# Altium schematic sheet SH6 - 17V POWER.SchDoc: Load Monitoring 2
size B; DrawnBy: Farris Matar; Engineer: Farris Matar; Organization: UW Robotics; Address1: 200 University Avenue; Address2: Waterloo; Address3: Ontario; Address4: Canada N2L 3G6; DocumentNumber: 6; Revision: 3; SheetNumber: 6; SheetTotal: 9
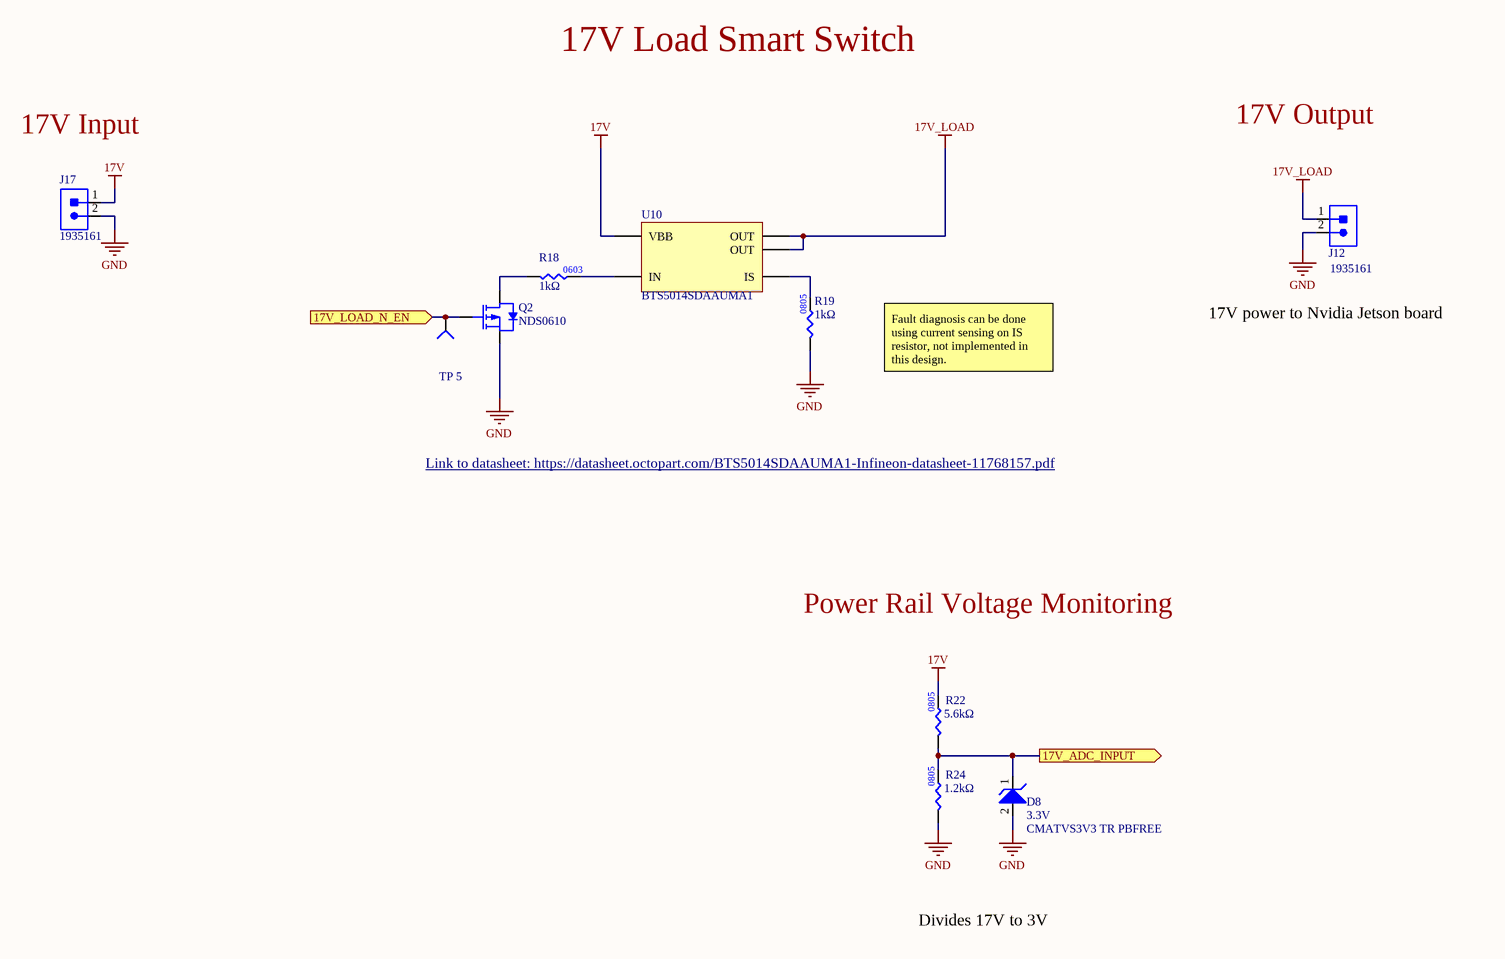
[diagram p0: SH6 - 17V POWER.SchDoc]

## Parts
D8  Manufacturer Part Number 1: CMATVS3V3 TR PBFREE  Voltage - Reverse Standoff (Typ): 3.3V  [SOD-923]  (hidden comment: TVS_DIODE_UNIDIR_3.3V_7A)
J12  CON_2M_TERM  [1935161]  (value not drawn)
J17  CON_2M_TERM  [1935161]  (value not drawn)
Q2  Manufacturer Part Number 1: NDS0610  [SOT23-3]  (hidden comment: PMOS_60V_120mA)
R18  value 1kΩ  [RES0603]  (hidden comment: RES_1kΩ_0603_5%)
R19  value 1kΩ  [RES0805]  (hidden comment: RES_1kΩ_0805_1%)
R22  value 5.6kΩ  [RES0805]  (hidden comment: RES_5.6kΩ_0805)
R24  value 1.2kΩ  [RES0805]  (hidden comment: RES_1.2kΩ_0805)
TP_5  TESTPOINT_1MM_CIRCLE  [TESTPOINT_CIRCLE_1MM]  (value not drawn)  (no BOM)
U10  BTS5014SDAAUMA1  [D2PAK-4]

## Ports
17V_ADC_INPUT (out), 17V_LOAD_N_EN (in)

## Nets
17V: J17.1 R22.2 U10.3(VBB)
17V_LOAD: J12.1 U10.1(OUT) U10.5(OUT)
GND: D8.2 J12.2 J17.2 Q2.2(Source) R19.1 R24.1
17V_ADC_INPUT: D8.1 R22.1 R24.2 ; port 17V_ADC_INPUT
17V_LOAD_N_EN: Q2.1(Gate) TP_5.1(=value) ; port 17V_LOAD_N_EN
NetQ2_3: Q2.3(Drain) R18.1
NetR18_2: R18.2 U10.2(IN)
NetR19_2: R19.2 U10.4(IS)

## Notes on the sheet
- 17V Load Smart Switch
- 17V Input
- 17V Output
- Fault diagnosis can be done using current sensing on IS resistor, not implemented in this design.
- 17V power to Nvidia Jetson board
- Link to datasheet: https://datasheet.octopart.com/BTS5014SDAAUMA1-Infineon-datasheet-11768157.pdf <https://datasheet.octopart.com/BTS5014SDAAUMA1-Infineon-datasheet-11768157.pdf>
- Power Rail Voltage Monitoring
- Divides 17V to 3V
- Title:
- Project:
- Date:
- Rev:
- Reviewer:
- Engineer:
- Sheet:
- of

## Library data of the parts
D8 = TVS_DIODE_UNIDIR_3.3V_7A: TVS DIODE 3.3VWM 11VC SOD923; Manufacturer 1: Central Semiconductor Corp; Voltage - Breakdown (Min): 5V; Voltage - Clamping (Max) @ Ipp: 11V; Mounting Type: SMD; Package/Footprint: SOD-923; Supplier 1: Digi-Key; Supplier Part Number 1: 1514-CMATVS3V3TRPBFREECT-ND; Supplier 2: Mouser; Supplier Part Number 2: 610-CMATVS3V3
J12 J17 = CON_2M_TERM: TERM BLK 2POS SIDE ENTRY 5MM; Manufacturer 1: Phoenix Contact; Max Current Rating: 16A; Current: 18A; Voltage: 300V; Package/Footprint: SMD; Supplier 1: Digi-Key; Supplier Part Number 1: 277-1667-ND; Manufacturer Part Number 1: 1935161; Mounting Type: TH
Q2 = PMOS_60V_120mA: MOSFET P-CH 60V 120MA SOT-23; Manufacturer 1: ON Semiconductor; Vgs (Max): ±20V; Vdss: 60V; Package/Footprint: SOT-23; Mounting Type: SMD; Id: 120mA; Supplier 1: Digi-Key; Supplier Part Number 1: NDS0610CT-ND
R18 = RES_1kΩ_0603_5%: RES 1K OHM 5% 1/10W 0603; Manufacturer 1: Yageo; Manufacturer Part Number 1: RC0603JR-071KL; Supplier Part Number 1: 311-1.0KGRCT-ND; Supplier 1: Digi-Key; Mounting Type: SMD; Package: 0603
R19 = RES_1kΩ_0805_1%: RES 1K OHM 1% 1/8W 0805; Manufacturer 1: Yageo; Manufacturer Part Number 1: RC0805FR-071KL; Supplier 1: Digi-Key; Mounting Type: SMD; Supplier Part Number 1: 311-1.00KCRCT-ND; LCSC Part #: C17513; Package: 0805
R22 = RES_5.6kΩ_0805_5%: RES 5.6K OHM 5% 1/8W 0805; Manufacturer 1: Yageo; Manufacturer Part Number 1: RC0805JR-075K6L; Supplier Part Number 1: 311-5.6KARCT-ND; Supplier 1: Digi-Key; Tolerance: 5%; Package: 0805
R24 = RES_1.2kΩ_0805_5%: RES 1.2K OHM 5% 1/8W 0805; Manufacturer 1: Yageo; Manufacturer Part Number 1: RC0805JR-071K2L; Supplier 1: Digi-Key; Supplier Part Number 1: 311-1.2KARCT-ND; Tolerance: 5%; Package: 0805
TP_5 = TESTPOINT_1MM_CIRCLE: TESTPOINT 1MM CIRCLE
U10 = BTS5014SDAAUMA1: IC PWR SWITCH N-CHAN 1:1 TO252-5; Manufacturer 1: Infineon Technologies; Package/Footprint: TO-252-5; Mounting Type: SMD; Manufacturer Part Number 1: BTS5014SDAAUMA1; Supplier 1: Digi-Key; Supplier Part Number 1: BTS5014SDAAUMA1CT-ND; Supplier 2: Mouser; Supplier Part Number 2: 726-BTS5014SDA